# Altium schematic sheet eBox_MCU.SchDoc: eBox_MCU
size A4; DocumentNumber: 3; SheetNumber: 3; SheetTotal: 9
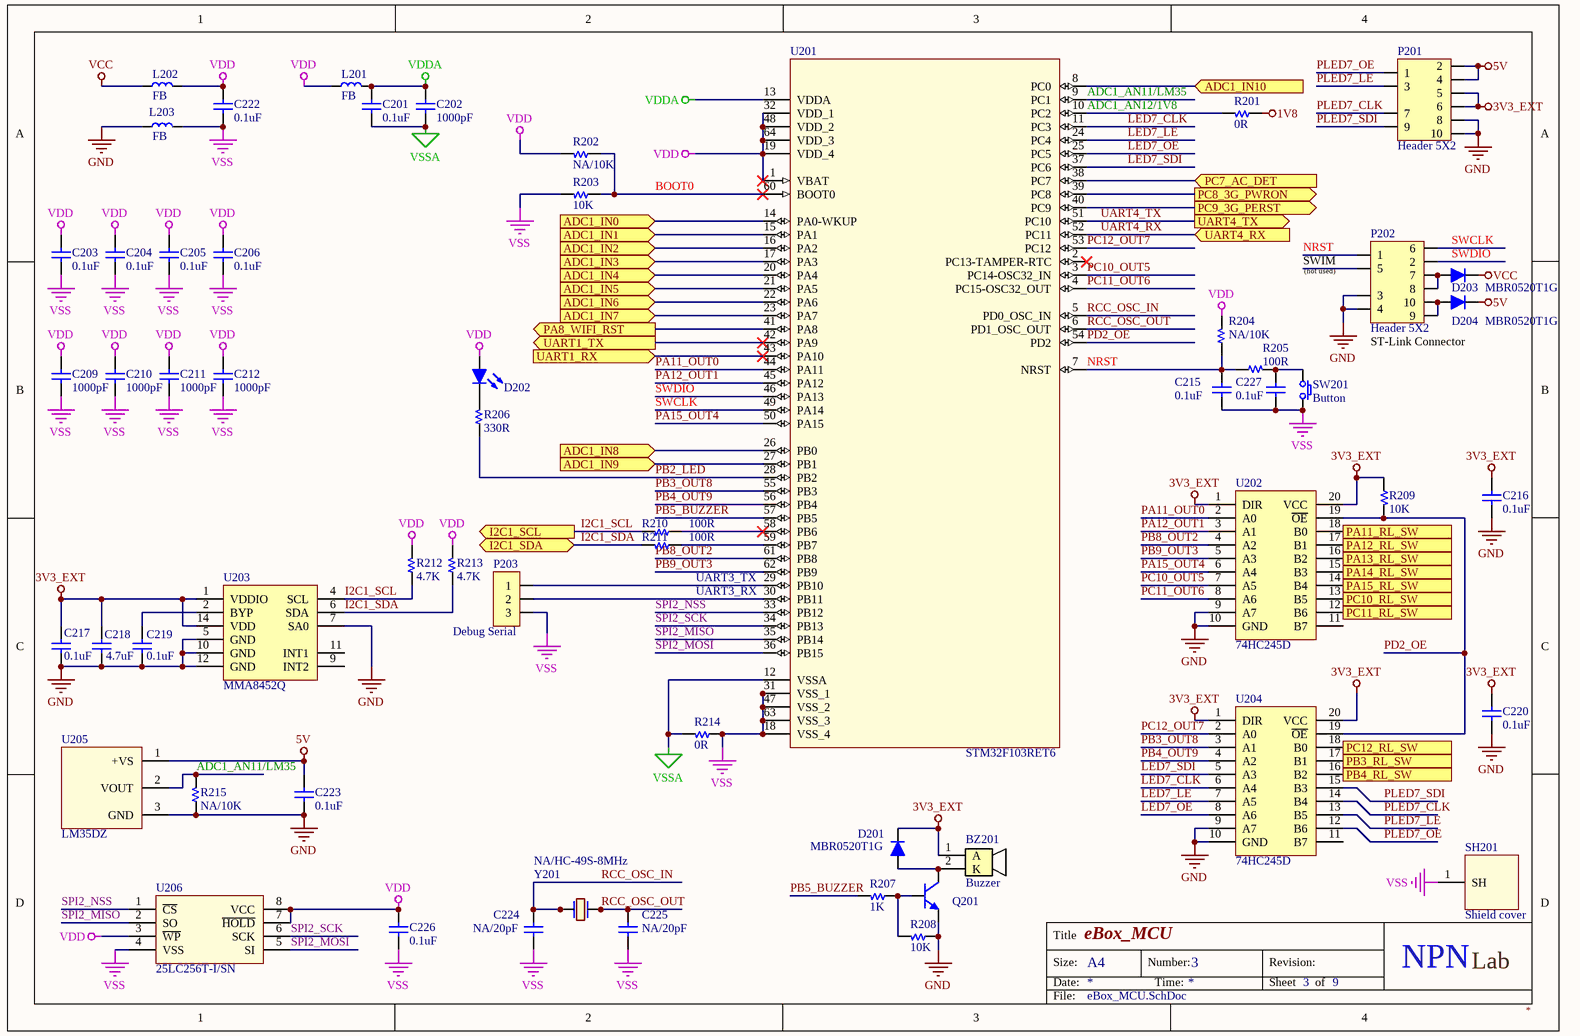
[diagram p0: eBox_MCU.SchDoc]

## Parts
BZ201  Buzzer  [BUZZER]
C201  0.1uF  [C 0603]
C202  1000pF  [C 0603]
C203  0.1uF  [C 0603]
C204  0.1uF  [C 0603]
C205  0.1uF  [C 0603]
C206  0.1uF  [C 0603]
C209  1000pF  [C 0603]
C210  1000pF  [C 0603]
C211  1000pF  [C 0603]
C212  1000pF  [C 0603]
C215  0.1uF  [C 0603]
C216  0.1uF  [C 0603]
C217  0.1uF  [C 0603]
C218  4.7uF  [C 0603]
C219  0.1uF  [C 0603]
C220  0.1uF  [C 0603]
C222  0.1uF  [C 0805]
C223  0.1uF  [C 0603]
C224  NA/20pF  [C 0603]
C225  NA/20pF  [C 0603]
C226  0.1uF  [C 0603]
C227  0.1uF  [C 0603]
D201  MBR0520T1G  [SOD123]
D202  5V Led  [LED 3MM - blue]  (value not drawn)
D203  MBR0520T1G  [SOD123]
D204  MBR0520T1G  [SOD123]
L201  FB  [L 0805 (2012)]
L202  FB  [L 0805 (2012)]
L203  FB  [L 0805 (2012)]
P201  Header 5X2  [HDR/Header/10/DL/BOX]
P202  Header 5X2  [HDR/Header/10/DL/BOX]
P203  Debug Serial  [HDR/Header/3]
Q201  MMBT3904LT1G  [SOT-23]  (value not drawn)
R201  0R  [R 0603]
R202  NA/10K  [R 0603]
R203  10K  [R 0603]
R204  NA/10K  [R 0603]
R205  100R  [R 0603]
R206  330R  [R 0603]
R207  1K  [R 0603]
R208  10K  [R 0603]
R209  10K  [R 0603]
R210  100R  [R 0603]
R211  100R  [R 0603]
R212  4.7K  [R 0603]
R213  4.7K  [R 0603]
R214  0R  [R 0603]
R215  NA/10K  [R 0603]
SH201  Shield cover  [SHIELD COVER 50x35]  (no BOM)
SW201  Button  [SW/2/DIP]
U201  STM32F103RET6  [STM-LQFP64]
U202  74HC245D  [SOIC-20]
U203  MMA8452Q  [MMA845xQ]
U204  74HC245D  [SOIC-20]
U205  LM35DZ  [TO-92/W100]
U206  25LC256T-I/SN  [SOIC-8-I/SN]
Y201  NA/HC-49S-8MHz  [Crystal HC49US SMD]
Y202  NA  [Crystal HC49S DIP]  (value not drawn)  (no BOM)

## Ports
ADC1_IN0 (in), ADC1_IN1 (in), ADC1_IN2 (in), ADC1_IN3 (in), ADC1_IN4 (in), ADC1_IN5 (in), ADC1_IN6 (in), ADC1_IN7 (in), ADC1_IN8 (in), ADC1_IN9 (in), ADC1_IN10 (in), I2C1_SCL (out), I2C1_SDA (bidir), PA8_WIFI_RST (out), PA11_RL_SW (out), PA12_RL_SW (out), PA13_RL_SW (out), PA14_RL_SW (out), PA15_RL_SW (out), PB3_RL_SW (out), PB4_RL_SW (out), PC7_AC_DET (in), PC8_3G_PWRON (out), PC9_3G_PERST (out), PC10_RL_SW (out), PC11_RL_SW (out), PC12_RL_SW (out), UART1_RX (in), UART1_TX (out), UART4_RX (in), UART4_TX (out)

## Nets
1V8: R201.1
3V3_EXT: BZ201.1(A) C216.1 C217.1 C218.1 C220.1 D201.2(K) P201.5 P201.6 R209.1 U202.1(DIR) U202.20(VCC) U203.1(VDDIO) U203.14(VDD) U204.1(DIR) U204.20(VCC)
5V: C223.1 D204.2(K) P201.2 P201.4 U205.1(+VS)
GND: C216.2 C217.2 C218.2 C219.2 C220.2 C223.2 L203.1 P201.8 P201.10 P202.3 P202.4 Q201.2(E) R208.1 R215.1 U202.9(A7) U202.10(GND) U203.5(GND) U203.7(SA0) U203.10(GND) U203.12(GND) U204.9(A7) U204.10(GND) U205.3(GND)
VCC: D203.2(K) L202.1
VDD: C203.1 C204.1 C205.1 C206.1 C209.1 C210.1 C211.1 C212.1 C222.1 C226.1 D202.1(A) L201.1 L202.2 R202.2 R204.2 R212.2 R213.2 U201.1(VBAT) U201.19(VDD_4) U201.32(VDD_1) U201.48(VDD_2) U201.64(VDD_3) U206.3(~{WP}) U206.7(~{HOLD}) U206.8(VCC)
VDDA: C201.1 C202.1 L201.2 U201.13(VDDA)
VSS: C203.2 C204.2 C205.2 C206.2 C209.2 C210.2 C211.2 C212.2 C215.2 C222.2 C224.2 C225.2 C226.2 C227.2 L203.2 P203.3 R203.2 R214.1 SH201.1(SH) SW201.2 U201.18(VSS_4) U201.31(VSS_1) U201.47(VSS_2) U201.63(VSS_3) U206.4(VSS)
VSSA: C201.2 C202.2 R214.2 U201.12(VSSA)
ADC1_AN11/LM35: R215.2 U201.9(PC1) U205.2(VOUT)
ADC1_AN12/1V8: R201.2 U201.10(PC2)
ADC1_IN0: U201.14(PA0-WKUP) ; port ADC1_IN0
ADC1_IN1: U201.15(PA1) ; port ADC1_IN1
ADC1_IN2: U201.16(PA2) ; port ADC1_IN2
ADC1_IN3: U201.17(PA3) ; port ADC1_IN3
ADC1_IN4: U201.20(PA4) ; port ADC1_IN4
ADC1_IN5: U201.21(PA5) ; port ADC1_IN5
ADC1_IN6: U201.22(PA6) ; port ADC1_IN6
ADC1_IN7: U201.23(PA7) ; port ADC1_IN7
ADC1_IN8: U201.26(PB0) ; port ADC1_IN8
ADC1_IN9: U201.27(PB1) ; port ADC1_IN9
ADC1_IN10: U201.8(PC0) ; port ADC1_IN10
BOOT0: R202.1 R203.1 U201.60(BOOT0)
I2C1_SCL: R210.2 R212.1 U203.4(SCL) ; port I2C1_SCL
I2C1_SDA: R211.2 R213.1 U203.6(SDA) ; port I2C1_SDA
LED7_CLK: U201.11(PC3) U204.6(A4)
LED7_LE: U201.24(PC4) U204.7(A5)
LED7_OE: U201.25(PC5) U204.8(A6)
LED7_SDI: U201.37(PC6) U204.5(A3)
NRST: C215.1 P202.1 R204.1 R205.1 U201.7(NRST)
PA8_WIFI_RST: U201.41(PA8) ; port PA8_WIFI_RST
PA11_OUT0: U201.44(PA11) U202.2(A0)
PA11_RL_SW: U202.18(B0) ; port PA11_RL_SW
PA12_OUT1: U201.45(PA12) U202.3(A1)
PA12_RL_SW: U202.17(B1) ; port PA12_RL_SW
PA13_RL_SW: U202.16(B2) ; port PA13_RL_SW
PA14_RL_SW: U202.15(B3) ; port PA14_RL_SW
PA15_OUT4: U201.50(PA15) U202.6(A4)
PA15_RL_SW: U202.14(B4) ; port PA15_RL_SW
PB2_LED: R206.1 U201.28(PB2)
PB3_OUT8: U201.55(PB3) U204.3(A1)
PB3_RL_SW: U204.17(B1) ; port PB3_RL_SW
PB4_OUT9: U201.56(PB4) U204.4(A2)
PB4_RL_SW: U204.16(B2) ; port PB4_RL_SW
PB5_BUZZER: R207.2 U201.57(PB5)
PB8_OUT2: U201.61(PB8) U202.4(A2)
PB9_OUT3: U201.62(PB9) U202.5(A3)
PC7_AC_DET: U201.38(PC7) ; port PC7_AC_DET
PC8_3G_PWRON: U201.39(PC8) ; port PC8_3G_PWRON
PC9_3G_PERST: U201.40(PC9) ; port PC9_3G_PERST
PC10_OUT5: U201.3(PC14-OSC32_IN) U202.7(A5)
PC10_RL_SW: U202.13(B5) ; port PC10_RL_SW
PC11_OUT6: U201.4(PC15-OSC32_OUT) U202.8(A6)
PC11_RL_SW: U202.12(B6) ; port PC11_RL_SW
PC12_OUT7: U201.53(PC12) U204.2(A0)
PC12_RL_SW: U204.18(B0) ; port PC12_RL_SW
PD2_OE: R209.2 U201.54(PD2) U202.19(~{OE}) U204.19(~{OE})
PLED7_CLK: P201.7 U204.14(B4)
PLED7_LE: P201.3 U204.13(B5)
PLED7_OE: P201.1 U204.12(B6)
PLED7_SDI: P201.9 U204.15(B3)
RCC_OSC_IN: C224.1 U201.5(PD0_OSC_IN) Y201.1 Y202.1
RCC_OSC_OUT: C225.1 U201.6(PD1_OSC_OUT) Y201.2 Y202.2
SPI2_MISO: U201.35(PB14) U206.2(SO)
SPI2_MOSI: U201.36(PB15) U206.5(SI)
SPI2_NSS: U201.33(PB12) U206.1(~{CS})
SPI2_SCK: U201.34(PB13) U206.6(SCK)
SWCLK: P202.6 U201.49(PA14)
SWDIO: P202.2 U201.46(PA13)
UART1_RX: U201.43(PA10) ; port UART1_RX
UART1_TX: U201.42(PA9) ; port UART1_TX
UART3_RX: P203.2 U201.30(PB11)
UART3_TX: P203.1 U201.29(PB10)
UART4_RX: U201.52(PC11) ; port UART4_RX
UART4_TX: U201.51(PC10) ; port UART4_TX
NetBZ201_2: BZ201.2(K) D201.1(A) Q201.3(C)
NetC219_1: C219.1 U203.2(BYP)
NetC227_1: C227.1 R205.2 SW201.1
NetD202_2: D202.2(K) R206.2
NetD203_1: D203.1(A) P202.7 P202.8
NetD204_1: D204.1(A) P202.9 P202.10
NetQ201_1: Q201.1(B) R207.1 R208.2
NetR210_1: R210.1 U201.58(PB6)
NetR211_1: R211.1 U201.59(PB7)

Not connected (* = marked no-connect by the designer): P202 5; U201 2(PC13-TAMPER-RTC)*; U202 11(B7); U203 9(INT2) 11(INT1); U204 11(B7)

## Notes on the sheet
- (near P202) SWIM
- (near P202) (not used)
- ST-Link Connector
- Title
- Size:
- Date:
- A4
- Number:
- Time:
- Revision:
- Sheet
- of
- NPN
- Lab
- File:

## Library data of the parts
C201-C206 C209-C212 C215-C217 C219 C220 C223 C226 C227 = Capacitor NP: CAP CER 0.1UF 50V X7R 0603; TYPE: SMD; PACKAGE: SMD0603; STOCK CODE: CC0603KRX7R9BB104; SUPPLIER: tme.vn; STOCK DESC: 100nF/50V ±10% X7R SMD-0603 Capacitor; UNIT PRICE: 400
C218 = Capacitor NP: CAP CER 4.7UF 50V X7R 0603; TYPE: SMD; PACKAGE: SMD0603; STOCK CODE: CC0603KRX5R6BB475; SUPPLIER: tme.vn; STOCK DESC: 4.7uF 10V ±10% X5R SMD-0603 Capacitor; UNIT PRICE: 600
C222 = Capacitor NP: CAP CER 0.1UF 50V X7R 0805; TYPE: SMD; PACKAGE: SMD0805; STOCK CODE: CL21B104KBNC; SUPPLIER: tme.vn; STOCK DESC: 100nF/50V ±10% X7R SMD-0805 Capacitor; UNIT PRICE: 400
C224 C225 = Capacitor NP: CAP CER 20pF 50V X7R 0603; TYPE: SMD; PACKAGE: SMD0603; STOCK CODE: CC0603JRNPO9BN100; SUPPLIER: tme.vn; STOCK DESC: 10pF/50V ±5% NPO SMD-0603 Capacitor; UNIT PRICE: 400
D201 D203 D204 = Diode: DIODE SCHOTTKY 20V 500MA SOD123; TYPE: SMD; PACKAGE: SOD123; PART NO: MBR0520T1G; STOCK CODE: MBR0520T1G; SUPPLIER: tme.vn; STOCK DESC: 0.5A 20V SMD Schottky Rectifier Diode; UNIT PRICE: 2000
D202 = Led: LED BLUE DIFFUSED 3MM ROUND T/H; TYPE: TH; PACKAGE: 3MM; STOCK CODE: HT204SURD; SUPPLIER: tme.vn; STOCK DESC: 3mm Base LED; UNIT PRICE: 300
L201-L203 = Inductor: Chip Ferrite Bead; TYPE: SMD; PACKAGE: SMD0805; STOCK CODE: CB2012D300ST(F); SUPPLIER: tme.vn; STOCK DESC: 30 Ohm SMD-0805 Chip Ferrite Bead; UNIT PRICE: 500
P201 P202 = Header 5X2: Header, 5-Pin, Dual row; TYPE: TH; UNIT PRICE: 0
P203 = Header 3: Header, 3-Pin; TYPE: TH; UNIT PRICE: 0
Q201 = Transistor NPN: TRANS NPN 40V 0.2A SOT23; TYPE: SMD; STOCK CODE: LMBT3904LT1G; SUPPLIER: tme.vn; STOCK DESC: NPN General-Purpose Amplifier SMD Transistor; UNIT PRICE: 600
R201-R204 R208 R209 R215 = Resistor: RES SMD 10K OHM 1% 1/10W 0603; PACKAGE: SMD0603; TYPE: SMD
  R201: UNIT PRICE: 0
  R202-R204 R208 R209 R215: STOCK CODE: 0603F1000T5E; SUPPLIER: tme.vn; STOCK DESC: 10K ±1% SMD-0603 Resistor; UNIT PRICE: 60
R205 R210 R211 = Resistor: RES SMD 100 OHM 1% 1/10W 0603; PACKAGE: SMD0603; STOCK CODE: RM06FTN1000; SUPPLIER: tme.vn; TYPE: SMD; STOCK DESC: 100R ±1% SMD-0603 Resistor; UNIT PRICE: 50
R206 = Resistor: RES SMD 330 OHM 1% 1/10W 0603; PACKAGE: SMD0603; STOCK CODE: RM06JTN331; SUPPLIER: tme.vn; TYPE: SMD; STOCK DESC: 330R ±5% SMD-0603 Resistor; UNIT PRICE: 50
R207 = Resistor: RES SMD 1K OHM 1% 1/10W 0603; PACKAGE: SMD0603; STOCK CODE: RM06JTN103; SUPPLIER: tme.vn; TYPE: SMD; STOCK DESC: 10K ±5% SMD-0603 Resistor; UNIT PRICE: 50
R212 R213 = Resistor: RES SMD 4.7K OHM 1% 1/10W 0603; PACKAGE: SMD0603; STOCK CODE: RM06JTN472; SUPPLIER: tme.vn; TYPE: SMD; STOCK DESC: 4.7K ±5% SMD-0603 Resistor; UNIT PRICE: 50
R214 = Resistor: RES SMD 0 OHM 5% 1/10W 0603; PACKAGE: SMD0603; STOCK CODE: RM06JTN0; SUPPLIER: tme.vn; TYPE: SMD; STOCK DESC: 0R ±5% SMD-0603 Resistor; UNIT PRICE: 50
SW201 = SW SPST: Tact switch 2 pin; STOCK CODE: KAN0611-0501B; SUPPLIER: tme.vn; TYPE: TH; STOCK DESC: Tact Switch 6x6x5 mm Black; UNIT PRICE: 1000
U201 = STM32F103RBT6: ARM® Cortex®-M3 series Microcontroller IC 32-Bit 72MHz 512KB (512K x 8) FLASH; Package: LQFP-64; PART NO: STM32F103RET6; STOCK CODE: STM32F103RET6; SUPPLIER: tme.vn; TYPE: SMD; STOCK DESC: MCU ARM 512KB FLASH LQFP-64; UNIT PRICE: 70000
U202 U204 = 74HC245D: IC TRANSCVR NON-INVERT 6V 20SO; BRAND: NXP; PACKAGE: SOIC-20; STOCK CODE: 74HC245D; SUPPLIER: tme.vn; TYPE: SMD; STOCK DESC: Octal bus transceiver; 3-state, Non-Inverting; UNIT PRICE: 5000
U203 = MMA845xQ: Freescale's 3-axis digital accelerometer; BRAND: Freescale; PACKAGE: QFN-16; PART NO: MMA8452Q; STOCK CODE: MMA8452Q; SUPPLIER: tme.vn; TYPE: SMD; STOCK DESC: 3-Axis, 12-bit/8-bit Digital Accelerometer; UNIT PRICE: 60000
U205 = LM35DZ: SENSOR ANALOG 0C-100C TO92-3; PACKAGE: TO-92; STOCK CODE: LM35DZ; SUPPLIER: tme.vn; TYPE: TH; STOCK DESC: Analog Thermometer; UNIT PRICE: 30000
U206 = 25LC256T-I/SN: IC EEPROM 256K SPI 10MHZ 8SOIC; PART NO: 25LC256-I/SN; BRAND: Microchip; PACKAGE: SOIC-8; STOCK CODE: 25LC256-I/SN; SUPPLIER: tme.vn; TYPE: SMD; STOCK DESC: 256 Kbit SPI Bus Serial EEPROM, 10MHZ 8SOIC; UNIT PRICE: 25000
Y201 = Crystal: 8 MHz HC-49S SMD Crystal; PACKAGE: HC49/US; STOCK CODE: 8M-HC49S SMD; SUPPLIER: tme.vn; TYPE: SMD; STOCK DESC: 8 MHz HC-49S SMD Crystal; UNIT PRICE: 4000
Y202 = Crystal: TYPE: NO-BOM
BZ201 = Buzzer: STOCK CODE: YMD-12065G-5V; SUPPLIER: tme.vn; TYPE: TH; STOCK DESC: 5V Magneticc Buzzer, 85dB, 6.5x12 mm; UNIT PRICE: 5000
SH201 = Shield cover: TYPE: NO-BOM